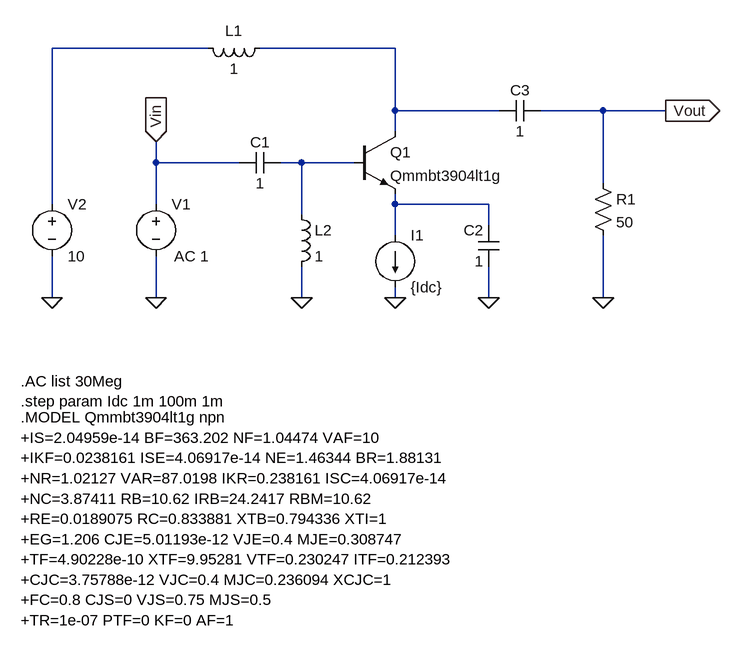
[diagram p0: schematic BJT_gain_characterization.asc]
BJT_gain_characterization.asc, the LTspice schematic file:
Version 4
SHEET 1 1144 900
WIRE -16 96 -256 96
WIRE 272 96 64 96
WIRE 272 192 272 96
WIRE 432 192 272 192
WIRE 592 192 496 192
WIRE 688 192 592 192
WIRE 272 224 272 192
WIRE -96 272 -96 240
WIRE 32 272 -96 272
WIRE 128 272 96 272
WIRE 208 272 128 272
WIRE 592 304 592 192
WIRE -256 336 -256 96
WIRE -96 336 -96 272
WIRE 272 336 272 320
WIRE 416 336 272 336
WIRE 128 352 128 272
WIRE 416 368 416 336
WIRE 272 384 272 336
WIRE -256 480 -256 416
WIRE -96 480 -96 416
WIRE 128 480 128 432
WIRE 272 480 272 464
WIRE 416 480 416 432
WIRE 592 480 592 384
FLAG -96 480 0
FLAG 272 480 0
FLAG -256 480 0
FLAG 416 480 0
FLAG 688 192 Vout
IOPIN 688 192 Out
FLAG -96 240 Vin
IOPIN -96 240 In
FLAG 128 480 0
FLAG 592 480 0
SYMBOL npn 208 224 R0
SYMATTR InstName Q1
SYMATTR Value Qmmbt3904lt1g
SYMBOL voltage -96 320 R0
WINDOW 123 28 96 Left 2
SYMATTR Value2 AC 1
SYMATTR InstName V1
SYMATTR Value ""
SYMBOL current 272 384 R0
SYMATTR InstName I1
SYMATTR Value {Idc}
SYMBOL cap 96 256 R90
WINDOW 0 0 32 VBottom 2
WINDOW 3 32 32 VTop 2
SYMATTR InstName C1
SYMATTR Value 1
SYMBOL voltage -256 320 R0
SYMATTR InstName V2
SYMATTR Value 10
SYMBOL ind 80 80 R90
WINDOW 0 5 56 VBottom 2
WINDOW 3 32 56 VTop 2
SYMATTR InstName L1
SYMATTR Value 1
SYMBOL cap 432 432 R180
WINDOW 0 24 56 Left 2
WINDOW 3 24 8 Left 2
SYMATTR InstName C2
SYMATTR Value 1
SYMBOL cap 496 176 R90
WINDOW 0 0 32 VBottom 2
WINDOW 3 32 32 VTop 2
SYMATTR InstName C3
SYMATTR Value 1
SYMBOL ind 112 336 R0
SYMATTR InstName L2
SYMATTR Value 1
SYMBOL res 576 288 R0
SYMATTR InstName R1
SYMATTR Value 50
TEXT -304 664 Left 2 !.MODEL Qmmbt3904lt1g npn\n+IS=2.04959e-14 BF=363.202 NF=1.04474 VAF=10\n+IKF=0.0238161 ISE=4.06917e-14 NE=1.46344 BR=1.88131\n+NR=1.02127 VAR=87.0198 IKR=0.238161 ISC=4.06917e-14\n+NC=3.87411 RB=10.62 IRB=24.2417 RBM=10.62\n+RE=0.0189075 RC=0.833881 XTB=0.794336 XTI=1\n+EG=1.206 CJE=5.01193e-12 VJE=0.4 MJE=0.308747\n+TF=4.90228e-10 XTF=9.95281 VTF=0.230247 ITF=0.212393\n+CJC=3.75788e-12 VJC=0.4 MJC=0.236094 XCJC=1\n+FC=0.8 CJS=0 VJS=0.75 MJS=0.5\n+TR=1e-07 PTF=0 KF=0 AF=1
TEXT -304 608 Left 2 !.AC list 30Meg\n.step param Idc 1m 100m 1m

The netlist it stands for:
* BJT_gain_characterization.asc
Q1 N002 N003 N004 0 Qmmbt3904lt1g
V1 Vin 0 AC 1
I1 N004 0 {Idc}
C1 N003 Vin 1
V2 N001 0 10
L1 N002 N001 1
C2 0 N004 1
C3 Vout N002 1
L2 N003 0 1
R1 Vout 0 50
.model NPN NPN
.model PNP PNP
.lib standard.bjt
.MODEL Qmmbt3904lt1g npn
+IS=2.04959e-14 BF=363.202 NF=1.04474 VAF=10
+IKF=0.0238161 ISE=4.06917e-14 NE=1.46344 BR=1.88131
+NR=1.02127 VAR=87.0198 IKR=0.238161 ISC=4.06917e-14
+NC=3.87411 RB=10.62 IRB=24.2417 RBM=10.62
+RE=0.0189075 RC=0.833881 XTB=0.794336 XTI=1
+EG=1.206 CJE=5.01193e-12 VJE=0.4 MJE=0.308747
+TF=4.90228e-10 XTF=9.95281 VTF=0.230247 ITF=0.212393
+CJC=3.75788e-12 VJC=0.4 MJC=0.236094 XCJC=1
+FC=0.8 CJS=0 VJS=0.75 MJS=0.5
+TR=1e-07 PTF=0 KF=0 AF=1
.AC list 30Meg
.step param Idc 1m 100m 1m
.backanno
.end